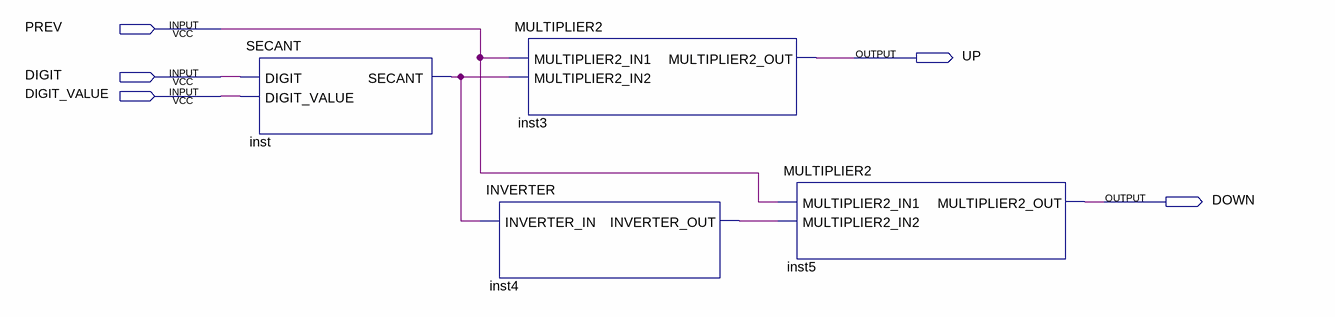
[diagram p0: schematic sheet]
// Quartus schematic SecantTreeNode.bdf as structural Verilog: 4 symbols, 5 pins
module SecantTreeNode (
  input  PREV,
  input  DIGIT,
  input  DIGIT_VALUE,
  output UP,
  output DOWN
);

  wire inst4_inverter_out, inst_secant;

  SECANT inst (.DIGIT(DIGIT), .DIGIT_VALUE(DIGIT_VALUE), .SECANT(inst_secant));
  INVERTER inst4 (.INVERTER_IN(inst_secant), .INVERTER_OUT(inst4_inverter_out));
  MULTIPLIER2 inst3 (.MULTIPLIER2_IN1(PREV), .MULTIPLIER2_IN2(inst_secant), .MULTIPLIER2_OUT(UP));
  MULTIPLIER2 inst5 (.MULTIPLIER2_IN1(PREV), .MULTIPLIER2_IN2(inst4_inverter_out), .MULTIPLIER2_OUT(DOWN));
endmodule
